# EAGLE design tdlf_01_04_2020_TOUCH (EAGLE 9.4.0)
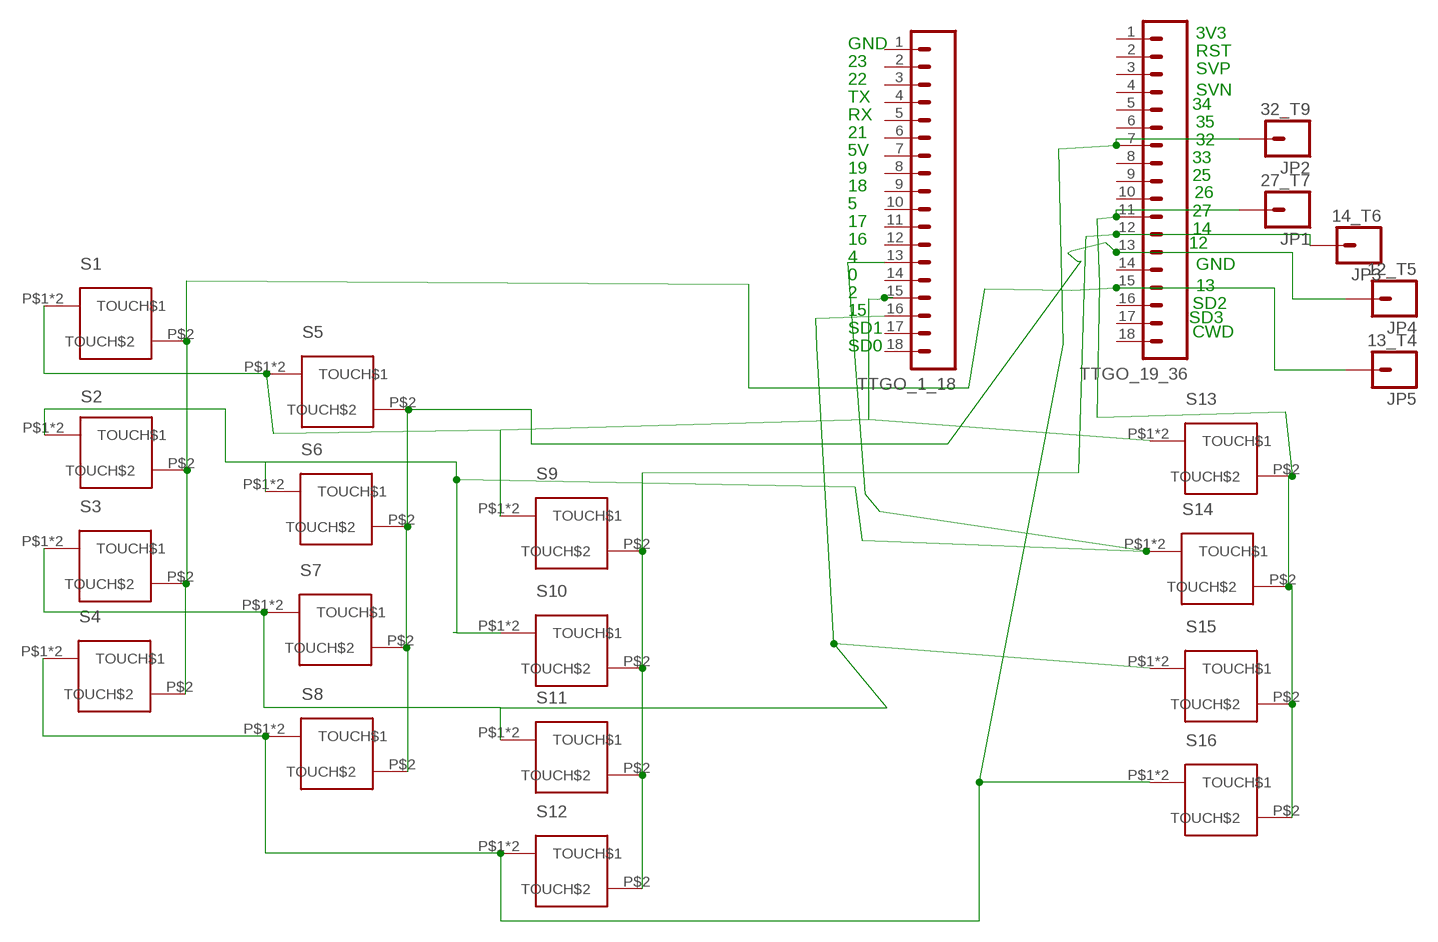
[diagram p0: schematic, sheet 1]

## Parts
JP1  27_T7  M01SMD-4.5X1.5  [PAD-1.5X4.5]
JP2  32_T9  M01SMD-4.5X1.5  [PAD-1.5X4.5]
JP3  14_T6  M01SMD-4.5X1.5  [PAD-1.5X4.5]
JP4  12_T5  M01SMD-4.5X1.5  [PAD-1.5X4.5]
JP5  13_T4  M01SMD-4.5X1.5  [PAD-1.5X4.5]
S1  DUALCAPACITIVEBUTTON  [R1206]
S2  DUALCAPACITIVEBUTTON  [R1206]
S3  DUALCAPACITIVEBUTTON  [R1206]
S4  DUALCAPACITIVEBUTTON  [R1206]
S5  DUALCAPACITIVEBUTTON  [R1206]
S6  DUALCAPACITIVEBUTTON  [R1206]
S7  DUALCAPACITIVEBUTTON  [R1206]
S8  DUALCAPACITIVEBUTTON  [R1206]
S9  DUALCAPACITIVEBUTTON  [R1206]
S10  DUALCAPACITIVEBUTTON  [R1206]
S11  DUALCAPACITIVEBUTTON  [R1206]
S12  DUALCAPACITIVEBUTTON  [R1206]
S13  DUALCAPACITIVEBUTTON  [R1206]
S14  DUALCAPACITIVEBUTTON  [R1206]
S15  DUALCAPACITIVEBUTTON  [R1206]
S16  DUALCAPACITIVEBUTTON  [R1206]
TTGO_1_18  M18_  [1X18]
TTGO_19_36  M18_  [1X18]

## Nets
TOUCH1_0: S2.P$1(TOUCH$1) S2.P$5(TOUCH$1) S6.P$1(TOUCH$1) S6.P$5(TOUCH$1) S10.P$1(TOUCH$1) S10.P$5(TOUCH$1) S14.P$1(TOUCH$1) S14.P$5(TOUCH$1) TTGO_1_18.13
TOUCH2_2: S1.P$1(TOUCH$1) S1.P$5(TOUCH$1) S5.P$1(TOUCH$1) S5.P$5(TOUCH$1) S9.P$1(TOUCH$1) S9.P$5(TOUCH$1) S13.P$1(TOUCH$1) S13.P$5(TOUCH$1) TTGO_1_18.15
TOUCH3_15: S3.P$1(TOUCH$1) S3.P$5(TOUCH$1) S7.P$1(TOUCH$1) S7.P$5(TOUCH$1) S11.P$1(TOUCH$1) S11.P$5(TOUCH$1) S15.P$1(TOUCH$1) S15.P$5(TOUCH$1) TTGO_1_18.16
TOUCH4_13: JP2.P$1 S4.P$1(TOUCH$1) S4.P$5(TOUCH$1) S8.P$1(TOUCH$1) S8.P$5(TOUCH$1) S12.P$1(TOUCH$1) S12.P$5(TOUCH$1) S16.P$1(TOUCH$1) S16.P$5(TOUCH$1) TTGO_19_36.7
TOUCH5_12: JP1.P$1 S13.P$2(TOUCH$2) S14.P$2(TOUCH$2) S15.P$2(TOUCH$2) S16.P$2(TOUCH$2) TTGO_19_36.11
TOUCH6_14: JP3.P$1 S9.P$2(TOUCH$2) S10.P$2(TOUCH$2) S11.P$2(TOUCH$2) S12.P$2(TOUCH$2) TTGO_19_36.12
TOUCH7_27: JP4.P$1 S5.P$2(TOUCH$2) S6.P$2(TOUCH$2) S7.P$2(TOUCH$2) S8.P$2(TOUCH$2) TTGO_19_36.13
TOUCH9_32: JP5.P$1 S1.P$2(TOUCH$2) S2.P$2(TOUCH$2) S3.P$2(TOUCH$2) S4.P$2(TOUCH$2) TTGO_19_36.15
Unconnected: TTGO_1_18.1 TTGO_1_18.2 TTGO_1_18.3 TTGO_1_18.4 TTGO_1_18.5 TTGO_1_18.6 TTGO_1_18.7 TTGO_1_18.8 TTGO_1_18.9 TTGO_1_18.10 TTGO_1_18.11 TTGO_1_18.12 TTGO_1_18.14 TTGO_1_18.17 TTGO_1_18.18 TTGO_19_36.1 TTGO_19_36.2 TTGO_19_36.3 TTGO_19_36.4 TTGO_19_36.5 TTGO_19_36.6 TTGO_19_36.8 TTGO_19_36.9 TTGO_19_36.10 TTGO_19_36.14 TTGO_19_36.16 TTGO_19_36.17 TTGO_19_36.18

## Notes on the sheet
- 3V3
- GND
- RST
- 23
- SVP
- 22
- SVN
- TX
- 34
- RX
- 35
- 21
- 32
- 5V
- 33
- 19
- 25
- 18
- 26
- 5
- 27
- 17
- 14
- 16 | 12
- 4
- GND
- 0
- 13
- 2
- SD2
- 15
- SD3
- SD1 | CWD
- SD0

## Library data of the parts
JP1-JP5 = SparkFun-Connectors:M01: Header 1 Standard 1-pin 0.1" header. Use with straight break away headers (SKU : PRT-00116), right angle break away headers (PRT-00553), swiss pins (PRT-00743), machine pins (PRT-00117), and female headers (PRT-00115).
S1-S16 = alx_lib:DUALCAPACITIVEBUTTON: Dual capacitive button
TTGO_1_18 TTGO_19_36 = SparkFun-Connectors:M18: 1x18 .1" header

## Board
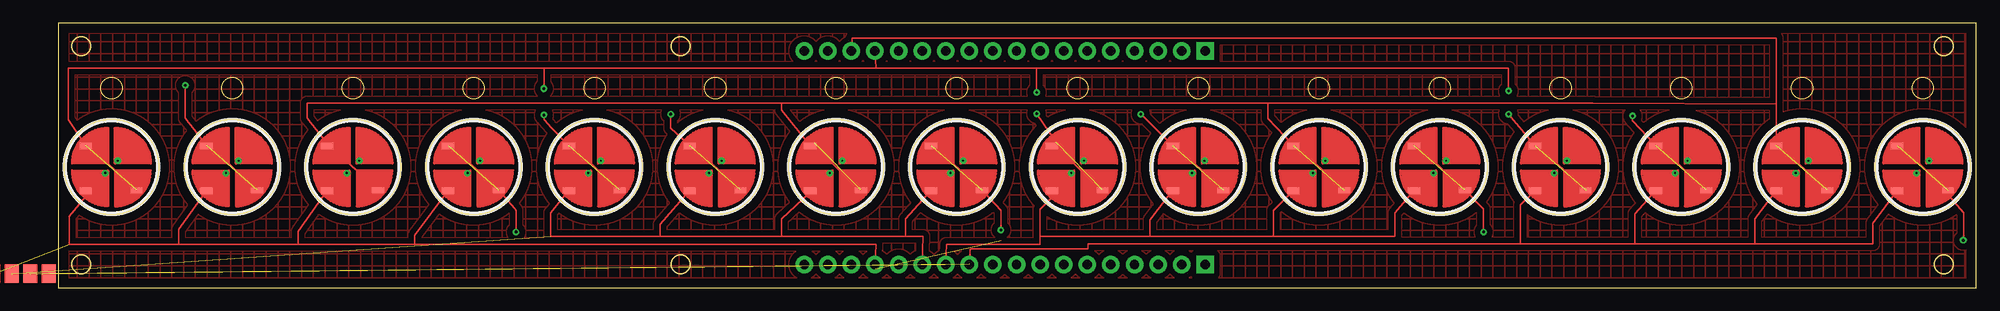
[diagram p1: board, top side]
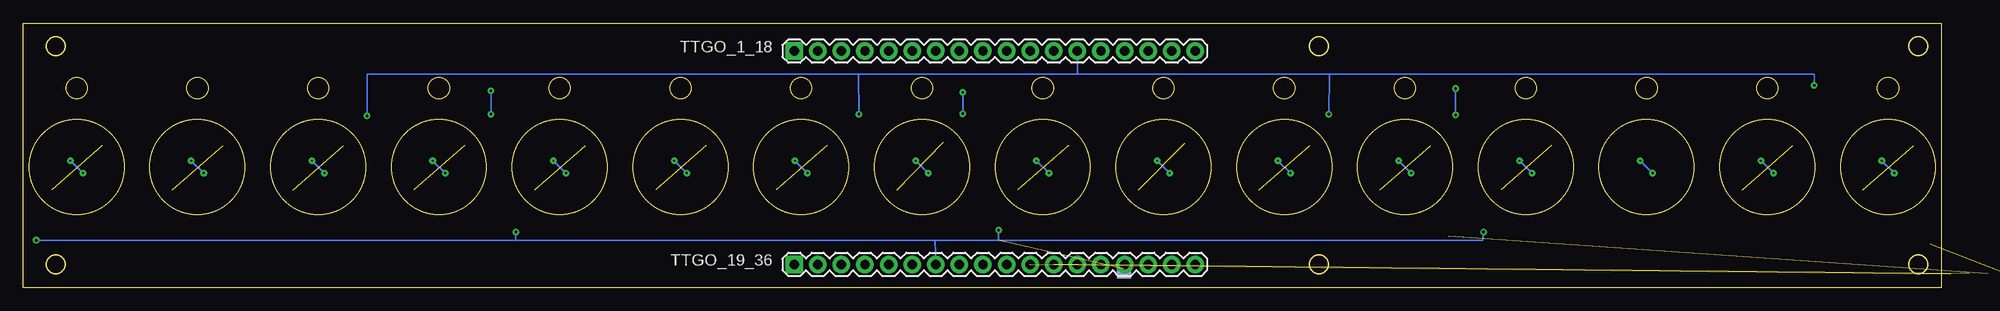
[diagram p2: board, bottom side, seen from below]

Size 206.5 x 28.5 mm. Coordinates in mm from the lower left corner, seen from the top.
Outline: 0,0 206.5,0 206.5,28.5 0,28.5 0,0
Copper layers (1*16): Top 0.035mm / dielectric 1.5mm / Bottom 0.035mm
Design rules "default": minimum track width 6mil, minimum drill 0.35mm, track to track 6mil, track to pad 6mil, pad to pad 6mil, via to via 6mil, smd to smd 6mil, copper to edge 40mil, drill to drill 6mil, minimum pad ring 10mil, minimum via ring 8mil, stop-mask expansion 4mil, vias tented up to drill 0mil, thermal gap 10mil
Milling: area 4.6,20.4 to 6.9,22.6; area 17.6,20.4 to 19.9,22.6; area 30.6,20.4 to 32.9,22.6; area 43.6,20.4 to 45.9,22.6; area 56.6,20.4 to 58.9,22.6; area 69.6,20.4 to 71.9,22.6; area 82.6,20.4 to 84.9,22.6; area 95.6,20.4 to 97.9,22.6; area 108.6,20.4 to 110.9,22.6; area 121.6,20.4 to 123.9,22.6; area 134.6,20.4 to 136.9,22.6; area 147.6,20.4 to 149.9,22.6; area 160.6,20.4 to 162.9,22.6; area 173.6,20.4 to 175.9,22.6; area 186.6,20.4 to 188.9,22.6; area 199.6,20.4 to 201.9,22.6; area 1.5,25 to 3.5,27; area 1.5,1.5 to 3.5,3.5; area 66,25 to 68,27; area 66,1.5 to 68,3.5; area 202,25 to 204,27; area 202,1.5 to 204,3.5

### Footprints (pad centres in the part's own frame; a part is rotated, then mirrored left to right if it is on the bottom)
PAD-1.5X4.5 = smd 1.5 x 2: P$1 0,0
R1206 = smd 1.422 x 0.711: P$1 -2.77,2.29; P$2 -2.77,-2.54 | drill 0.2 pad 0.254: P$3 -0.676,-0.651; P$4 0.676,0.676 | smd 1.27 x 0.635: P$5 2.7,-2.5
1X18 = drill 1.016 pad 1.88 square: 1 0,0 | drill 1.016 pad 1.88: 2 2.54,0; 3 5.08,0; 4 7.62,0; 5 10.16,0; 6 12.7,0; 7 15.24,0; 8 17.78,0; 9 20.32,0; 10 22.86,0; 11 25.4,0; 12 27.94,0; 13 30.48,0; 14 33.02,0; 15 35.56,0; 16 38.1,0; 17 40.64,0; 18 43.18,0

### Placement (x,y rotation side)
JP1  -1,1.5 0 top
JP2  88,2 0 bottom
JP3  -3,1.5 0 top
JP4  -5,1.5 0 top  (outside the outline)
JP5  -7,1.5 0 top  (outside the outline)
S1  5.75,13 0 top
S2  18.75,13 0 top
S3  31.75,13 0 top
S4  44.75,13 0 top
S5  57.75,13 0 top
S6  70.75,13 0 top
S7  83.75,13 0 top
S8  96.75,13 0 top
S9  109.75,13 0 top
S10  122.75,13 0 top
S11  135.75,13 0 top
S12  148.75,13 0 top
S13  161.75,13 0 top
S14  174.75,13 0 top
S15  187.75,13 0 top
S16  200.75,13 0 top
TTGO_1_18  123.5,25.5 0 bottom
TTGO_19_36  123.5,2.5 0 bottom

### Tracks (layer width: path | path; a pad name or v marks a point on that pad's centre or on a via)
GND
  pour Top (isolate 0.61, hatched): 0.5,28 0.5,0.5 206,0.5 206,28
TOUCH1_0  (via drill 0.3)  (4 unrouted)
  Top 0.152: S10.P$1 117,18.27 v116.55,18.7 | S6.P$1 65.96,17.21 65.95,18.5 v65.95,18.7 | S2.P$1 13.7,18.3 v13.7,21.8 | S14.P$1 169.5,18 v169.5,18.5
  Bottom 0.152: 93,23.03 112.8,23.03 112.8,23.02 116.6,23.02 | 93,23.03 90.57,23.03 90.57,23 65.24,23 | 65.24,23 13.7,23 v13.7,21.8 | 116.6,23.02 165.48,23.02 169.5,23 v169.5,18.5 | 65.96,22.98 65.9,22.98 | 65.9,22.98 65.24,23 | v65.95,18.7 65.9,22.98 | v116.55,18.7 116.6,23.02 | TTGO_1_18.13 93.02,23.05 93,23.03
TOUCH2_2  (via drill 0.3)  (4 unrouted)
  Top 0.152: 88.03,23.66 56.03,23.66 | 88.03,23.66 105.33,23.66 | 105.33,23.66 105.33,21.6 v105.35,21.05 | S5.P$1 53.13,17.21 52.35,18.1 v52.3,18.6 | 88.03,23.66 53.13,23.66 52.3,23.65 | v105.35,18.75 107.45,15.7 S9.P$1 | v52.3,21.45 52.3,23.65 | 52.3,23.65 | S1.P$1 1.1,18.1 1.1,23.65 52.3,23.65 | v156.15,18.7 S13.P$1 | TTGO_1_18.15 88.03,23.66 | v156.15,21.2 156.15,23.66 105.33,23.66
  Bottom 0.152: v105.35,21.05 v105.35,18.75 | v52.3,18.6 v52.3,21.45 | v156.15,21.2 v156.15,18.7
TOUCH3_15  (3 unrouted)
  Top 0.152: S15.P$1 184.98,19.8 | S3.P$5 29.9,14.67 | 29.9,14.67 29.77,14.8 | 29.9,14.67 S3.P$1 28.98,15.55 26.8,18.28 26.83,19.9 | 77.9,19.89 26.83,19.9 | 77.9,19.89 77.9,19.11 80.74,15.59 S7.P$1 81.45,15.56 | 77.9,19.89 130.25,19.89 | S11.P$1 130.25,18.2 130.25,19.89 | 130.25,19.89 165.2,19.89 184.98,19.8 | 26.83,19.89 26.83,19.9 | TTGO_1_18.16 85.49,26.89 184.98,26.89 184.98,19.8
TOUCH4_13  (via drill 0.3)  (5 unrouted)
  Top 0.152: S4.P$5 49.15,8.52 49.32,8.32 49.3,6.7 v49.3,6 | S8.P$5 101.52,8.32 101.5,6.7 v101.5,6.2 | S12.P$5 153.46,8.49 v153.46,6 | S16.P$5 203.45,10.02 205.16,8.04 205.16,5.1 v205.1,5.1
  Bottom 0.152: 101.5,5.1 49.39,5.1 v49.3,6 | 101.5,5.1 108.35,5.1 | 108.35,5.1 153.5,5.1 | 153.5,5.1 v205.1,5.1 | v101.5,6.2 101.5,5.1 | v153.46,6 153.5,6 153.5,5.1 | TTGO_19_36.7 108.35,5.1
TOUCH5_12  (1 unrouted)
  Top 0.152: 157.44,4.7 110.89,4.7 110.89,4.18 98.3,4.18 98.19,4.08 TTGO_19_36.11 | 157.44,4.7 169.72,4.7 | 182.67,4.7 169.72,4.7 | 158.58,10.06 S13.P$2 158.98,10.86 159.43,10.86 159.43,10.06 158.58,10.06 | 158.58,10.06 157.44,8.92 157.44,4.7 | S14.P$2 169.72,7.94 169.72,4.7 | S15.P$2 182.67,7.43 182.67,4.7 | S16.P$2 195.37,6.92 195.37,4.7 182.67,4.7
TOUCH6_14  (1 unrouted)
  Top 0.152: 130.86,5.5 117.52,5.5 | 117.52,5.5 108.35,5.5 108.35,5.51 105.71,5.51 | S10.P$2 117.52,7.3 117.52,5.5 | S11.P$2 130.86,8.32 130.86,5.5 | S12.P$2 143.94,8.06 143.94,5.5 130.86,5.5 | S9.P$2 106.98,9.71 105.71,8.45 105.71,5.51 | TTGO_19_36.12 95.65,4.64 105.71,4.64 105.71,5.51
TOUCH7_27  (1 unrouted)
  Top 0.152: S6.P$2 64.82,6.8 64.82,5.5 | S5.P$2 53.01,8.06 53.01,5.51 64.82,5.5 | 64.82,5.5 77.9,5.5 | 77.9,5.5 77.9,7.38 80.93,10.24 80.82,10.99 S7.P$2 | 77.9,5.5 91.23,5.5 | S8.P$2 91.23,7.43 91.23,5.5 | 91.23,5.5 93.11,5.5 TTGO_19_36.13
TOUCH9_32  (1 unrouted)
  Top 0.152: 29,10.44 S3.P$2 25.83,6.06 25.83,4.66 | 25.83,4.66 13,4.65 13,4.66 | 13,4.66 1.19,4.65 1.19,7.68 3.51,10.49 | 3.51,10.49 3.6,10.61 3.86,10.73 | S2.P$2 13,6.29 13,4.66 | 25.83,4.66 38.4,4.65 | S4.P$2 38.4,5.65 38.4,4.65 | S1.P$2 3.51,10.49 | TTGO_19_36.15 88.06,4.65 38.4,4.65